# EAGLE design schemat (EAGLE 6.4)
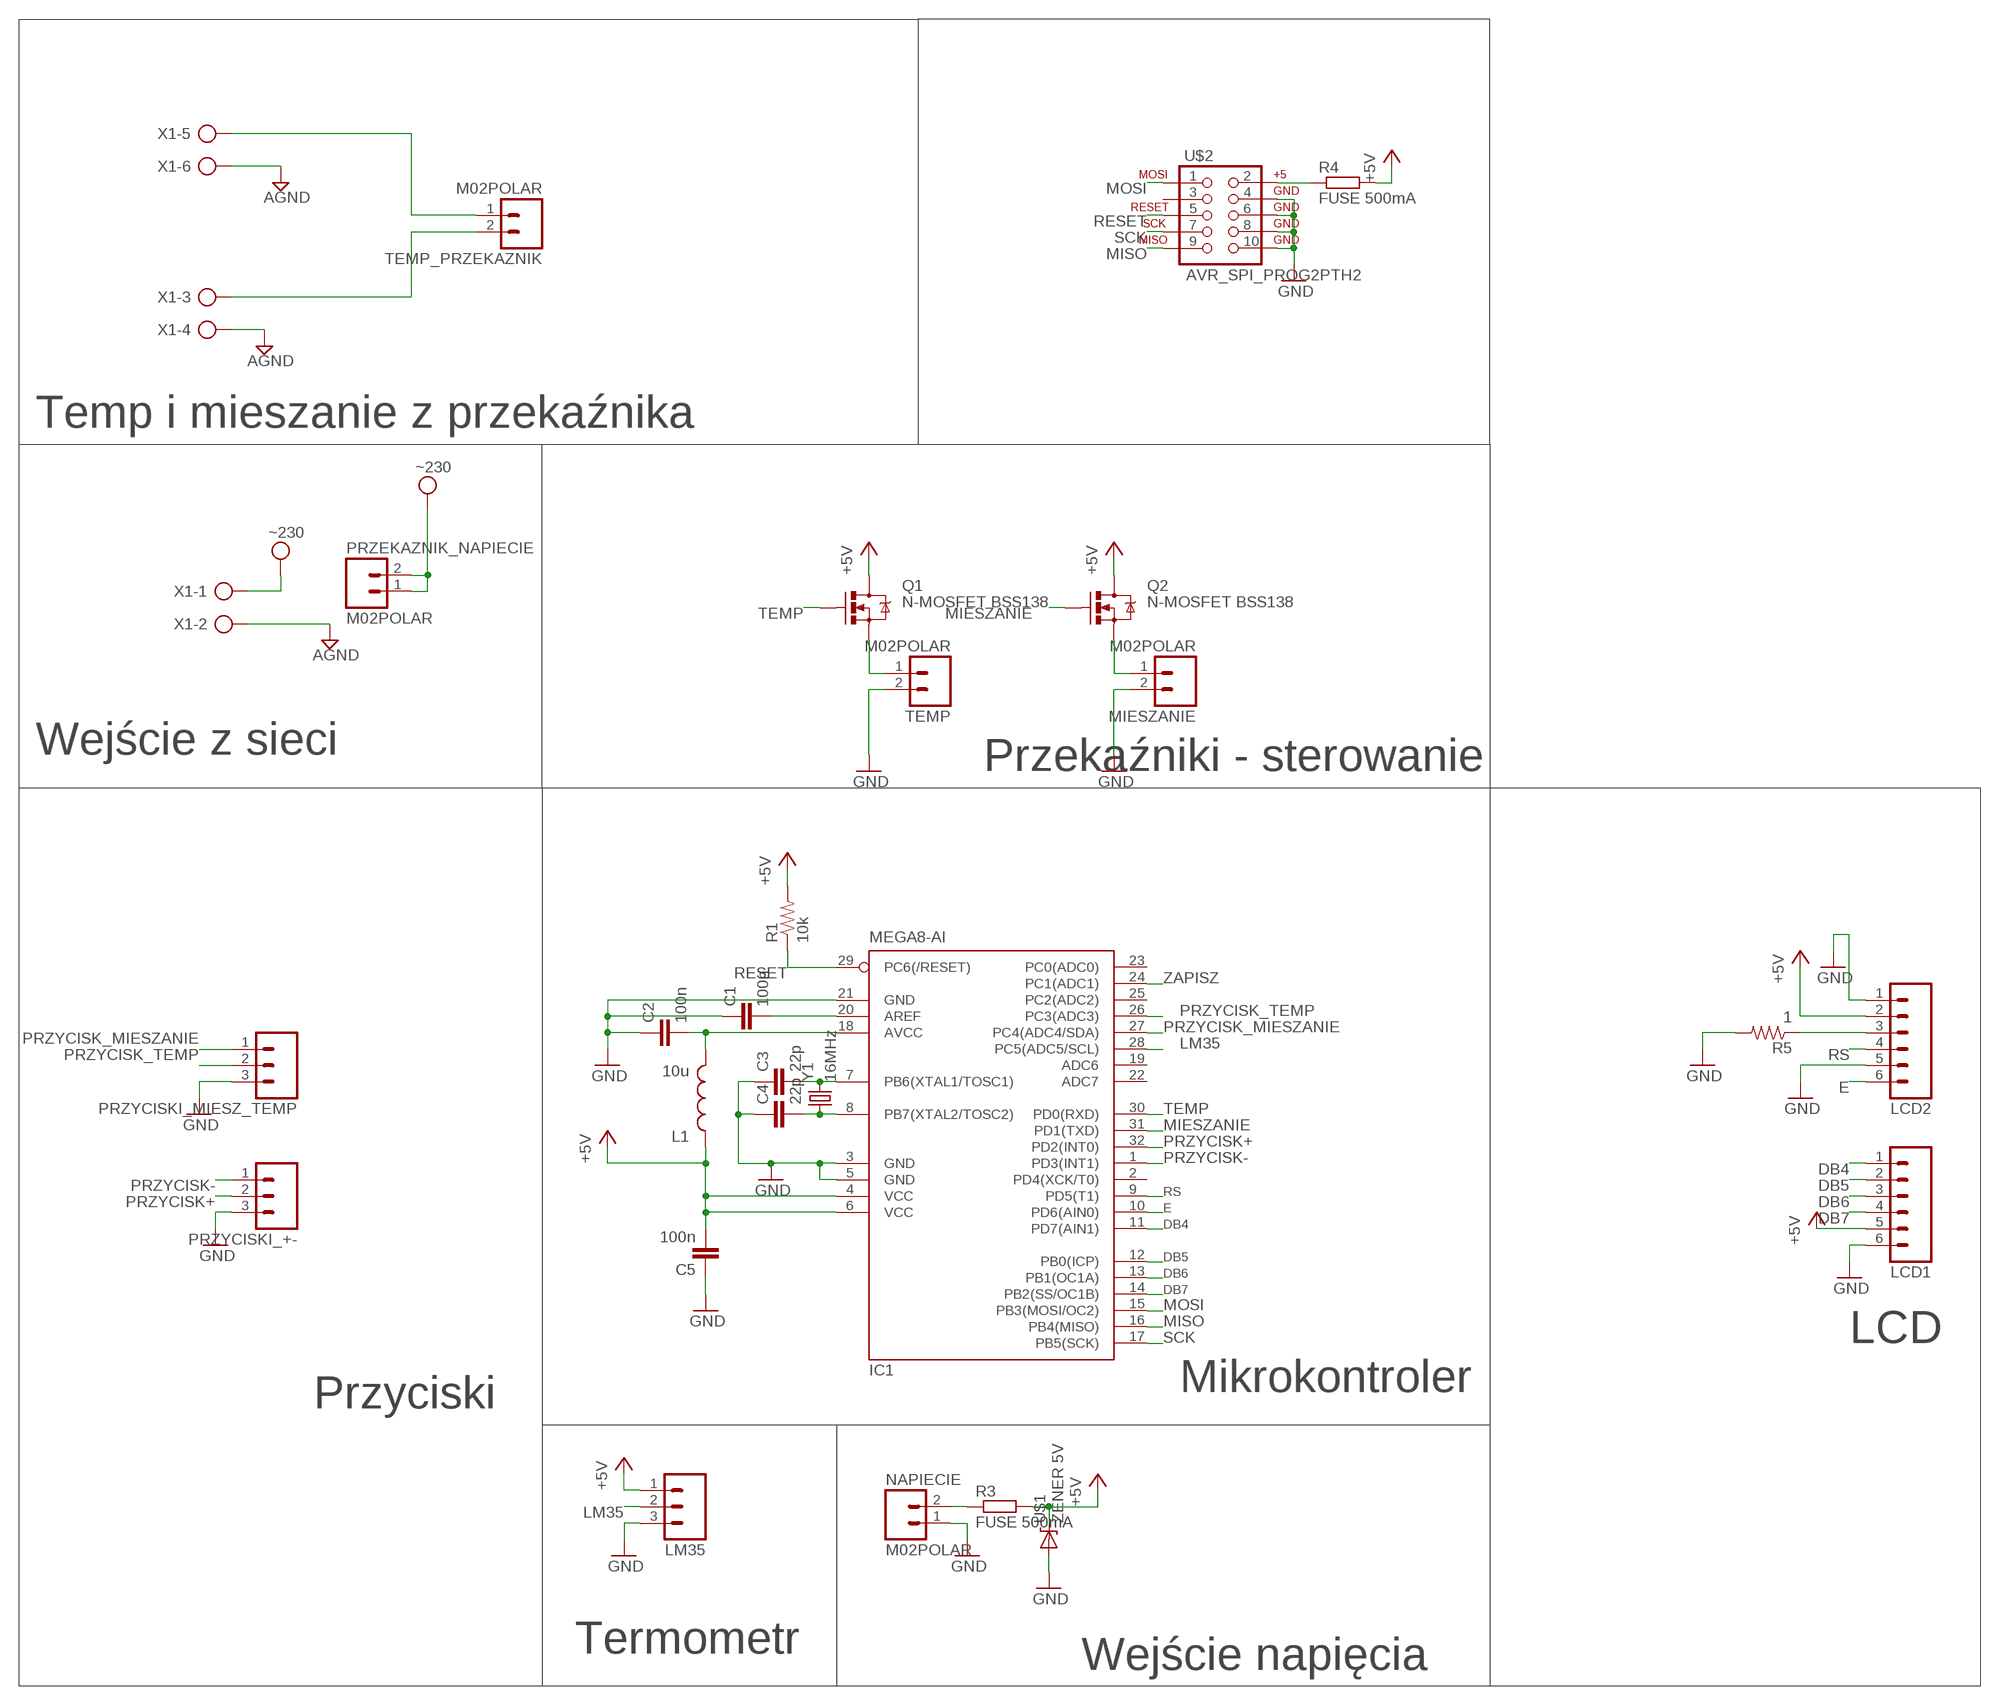
[diagram p0: schematic, sheet 1]

## Parts
C1  100n  CAP0805  [0805]
C2  100n  CAP0805  [0805]
C3  22p  CAP0805  [0805]
C4  22p  CAP0805  [0805]
C5  100n  CAP0805  [0805]
IC1  MEGA8-AI  [TQFP32-08]
L1  10u  INDUCTOR0805  [0805]
LCD1  M06POLAR  [MOLEX-1X6]
LCD2  M06POLAR  [MOLEX-1X6]
LM35  M03POLAR  [MOLEX-1X3]
MIESZANIE  M02POLAR  [MOLEX-1X2]
NAPIECIE  M02POLAR  [MOLEX-1X2]
PRZEKAZNIK_NAPIECIE  M02POLAR  [MOLEX-1X2]
PRZYCISKI_+-  M03POLAR  [MOLEX-1X3]
PRZYCISKI_MIESZ_TEMP  M03POLAR  [MOLEX-1X3]
Q1  N-MOSFET BSS138  MOSFET-NCHANNELBSS123LT1G  [SOT23]
Q2  N-MOSFET BSS138  MOSFET-NCHANNELBSS123LT1G  [SOT23]
R1  10k  RESISTOR0805-RES  [0805]
R3  FUSE 500mA  R-EU_M0805  [M0805]
R4  FUSE 500mA  R-EU_M0805  [M0805]
R5  1  RESISTOR0805-RES  [0805]
TEMP  M02POLAR  [MOLEX-1X2]
TEMP_PRZEKAZNIK  M02POLAR  [MOLEX-1X2]
U$1  ZENER 5V  DIODE-ZENERSMB  [SMB-DIODE]
U$2  AVR_SPI_PROG2PTH2  [2X5-SHROUDED]
X1  AK300/6  [AK300/6]
Y1  16MHz  CRYSTALHC49US  [HC49US]

## Nets
+5V: C5.2 IC1.4(VCC) IC1.6(VCC) L1.1 LCD1.5 LCD2.2 LM35.1 Q1.3(D) Q2.3(D) R1.2 R3.2 R4.2 U$1.C
AGND: X1.2 X1.4 X1.6
DB4: IC1.11(PD7(AIN1)) LCD1.1
DB5: IC1.12(PB0(ICP)) LCD1.2
DB6: IC1.13(PB1(OC1A)) LCD1.3
DB7: IC1.14(PB2(SS/OC1B)) LCD1.4
E: IC1.10(PD6(AIN0)) LCD2.6
GND: C1.1 C2.1 C3.1 C4.1 C5.1 IC1.3(GND) IC1.5(GND) IC1.21(GND) LCD1.6 LCD2.1 LCD2.5 LM35.3 MIESZANIE.2 NAPIECIE.1 PRZYCISKI_+-.3 PRZYCISKI_MIESZ_TEMP.3 R5.2 TEMP.2 U$1.A U$2.4 U$2.6 U$2.8 U$2.10
LM35: IC1.28(PC5(ADC5/SCL)) LM35.2
MIESZANIE: IC1.31(PD1(TXD)) Q2.1(G)
MISO: IC1.16(PB4(MISO)) U$2.9
MOSI: IC1.15(PB3(MOSI/OC2)) U$2.1
N$2: C2.2 IC1.18(AVCC) L1.2
N$3: C1.2 IC1.20(AREF)
N$4: Q1.2(S) TEMP.1
N$5: MIESZANIE.1 Q2.2(S)
N$6: C4.2 IC1.8(PB7(XTAL2/TOSC2)) Y1.1
N$7: C3.2 IC1.7(PB6(XTAL1/TOSC1)) Y1.2
N$8: NAPIECIE.2 R3.1
N$10: TEMP_PRZEKAZNIK.2 X1.3
N$11: R4.1 U$2.2
N$14: TEMP_PRZEKAZNIK.1 X1.5
N$16: LCD2.3 R5.1
PRZYCISK+: IC1.32(PD2(INT0)) PRZYCISKI_+-.2
PRZYCISK-: IC1.1(PD3(INT1)) PRZYCISKI_+-.1
PRZYCISK_MIESZANIE: IC1.27(PC4(ADC4/SDA)) PRZYCISKI_MIESZ_TEMP.1
PRZYCISK_TEMP: IC1.26(PC3(ADC3)) PRZYCISKI_MIESZ_TEMP.2
RESET: IC1.29(PC6(/RESET)) R1.1 U$2.5
RS: IC1.9(PD5(T1)) LCD2.4
SCK: IC1.17(PB5(SCK)) U$2.7
TEMP: IC1.30(PD0(RXD)) Q1.1(G)
VDD: PRZEKAZNIK_NAPIECIE.1 PRZEKAZNIK_NAPIECIE.2 X1.1 ; supply symbol labelled ~230
ZAPISZ: IC1.24(PC1(ADC1))
Unconnected: IC1.2(PD4(XCK/T0)) IC1.19(ADC6) IC1.22(ADC7) IC1.23(PC0(ADC0)) IC1.25(PC2(ADC2)) U$2.3

## Notes on the sheet
- Temp i mieszanie z przekaźnika
- Wejście z sieci
- Przekaźniki - sterowanie
- LCD
- Mikrokontroler
- Przyciski
- Termometr
- Wejście napięcia

## Library data of the parts
C1-C5 = SparkFun-Passives:CAP: Capacitor Standard 0603 ceramic capacitor, and 0.1" leaded capacitor.
IC1 = atmel:MEGA8: MICROCONTROLLER 8 Kbytes FLASH, 1 kbytes SRAM, 512 bytes EEPROM, USART, 6-channel 10 bit ADC, 2-channel 8 bit ADC Pin compatible with Atmega48, ATMega88, ATMega168 Source: avr.lbr; MPN: ATMEGA8-16AU; OC_FARNELL: 9171371; OC_NEWARK: 73M8863
L1 = SparkFun-Passives:INDUCTOR: Inductors Basic Inductor/Choke - 0603 and 1206. Footprints are not proven and vary greatly between part numbers. SRN6045- 33uH, 20% 1.4A SDR0403-560KL - 56uH, 10%, 500mA RMS/740mA peak
LCD1 LCD2 = SparkFun-Connectors:M06: Header 6 Standard 6-pin 0.1" header. Use with straight break away headers (SKU : PRT-00116), right angle break away headers (PRT-00553), swiss pins (PRT-00743), machine pins (PRT-00117), and female headers (PRT-00115). Molex polarized connector foot print use with SKU : PRT-08094 with associated crimp pins and housings. NOTES ON THE VARIANTS LOCK and LOCK_LONGPADS... This footprint was designed to help hold the alignment of a through-hole component (i.e. 6-pin header) while soldering it into place. You may notice that each hole has been shifted either up or down by 0.005 of an inch from it's more standard position (which is a perfectly straight line). This slight alteration caused the pins (the squares in the middle) to touch the edges of the holes. Because they are alternating, it causes a "brace" to hold the component in place. 0.005 has proven to be the perfect amount of "off-center" position when using our standard breakaway headers. Although looks a little odd when you look at the bare footprint, once you have a header in there, the alteration is very hard to notice. Also,if you push a header all the way into place, it is covered up entirely on the bottom side. This idea of altering the position of holes to aid alignment will be further integrated into the Sparkfun Library for other footprints. It can help hold any component with 3 or more connection pins.
LM35 PRZYCISKI_+- PRZYCISKI_MIESZ_TEMP = SparkFun-Connectors:M03: Header 3 Standard 3-pin 0.1" header. Use with straight break away headers (SKU : PRT-00116), right angle break away headers (PRT-00553), swiss pins (PRT-00743), machine pins (PRT-00117), and female headers (PRT-00115). Molex polarized connector foot print use with SKU : PRT-08232 with associated crimp pins and housings.
MIESZANIE NAPIECIE PRZEKAZNIK_NAPIECIE TEMP TEMP_PRZEKAZNIK = SparkFun-Connectors:M02: Standard 2-pin 0.1" header. Use with - straight break away headers ( PRT-00116) - right angle break away headers (PRT-00553) - swiss pins (PRT-00743) - machine pins (PRT-00117) - female headers (PRT-00115) Molex polarized connector foot print use with: PRT-08233 with associated crimp pins and housings. 2.54_SCREWTERM for use with PRT-10571. 3.5mm Screw Terminal footprints for PRT-08084 5mm Screw Terminal footprints for use with PRT-08433
Q1 Q2 = SparkFun-DiscreteSemi:MOSFET-NCHANNEL: Common NMOSFET Parts MFG P/N Store ID Prod ID FDD8780 TRANS-09984 SI7820DN TRANS-11055 FDS6630A IC-08089 2N7002PW TRANS-11151 FQP30N06L COM-10213 TRANS-10060 BSS123LT1G TRANS-08345 BSS138 TRANS-00830 BS170 2N7000; PROD_ID: TRANS-08345
R1 R5 = SparkFun-Passives:RESISTOR: Resistor Basic schematic elements and footprints for 0603, 1206, and PTH resistors.
R3 R4 = resistor:R-EU_: RESISTOR, European symbol
U$1 = SparkFun-DiscreteSemi:DIODE-ZENER: Zener Diode Production Part - 8199 3.4V Zener Voltage
U$2 = SparkFun-Connectors:AVR_SPI_PROG2: AVR 10-pin ICSP Header This is the standard AVR In Circuit Serial Programming header. Minimal, but includes pin one indicator. Works with standard Olimex programmers. Also look for the 6-pin reduced version. Spark Fun Electronics SKU: PRT-00778
X1 = con-ptr500:AK300/6: CONNECTOR; OC_FARNELL: unknown; OC_NEWARK: unknown
Y1 = SparkFun-FreqCtrl:CRYSTAL: Various standard crystals. Proven footprints. Spark Fun Electronics SKU : COM-00534

## Board
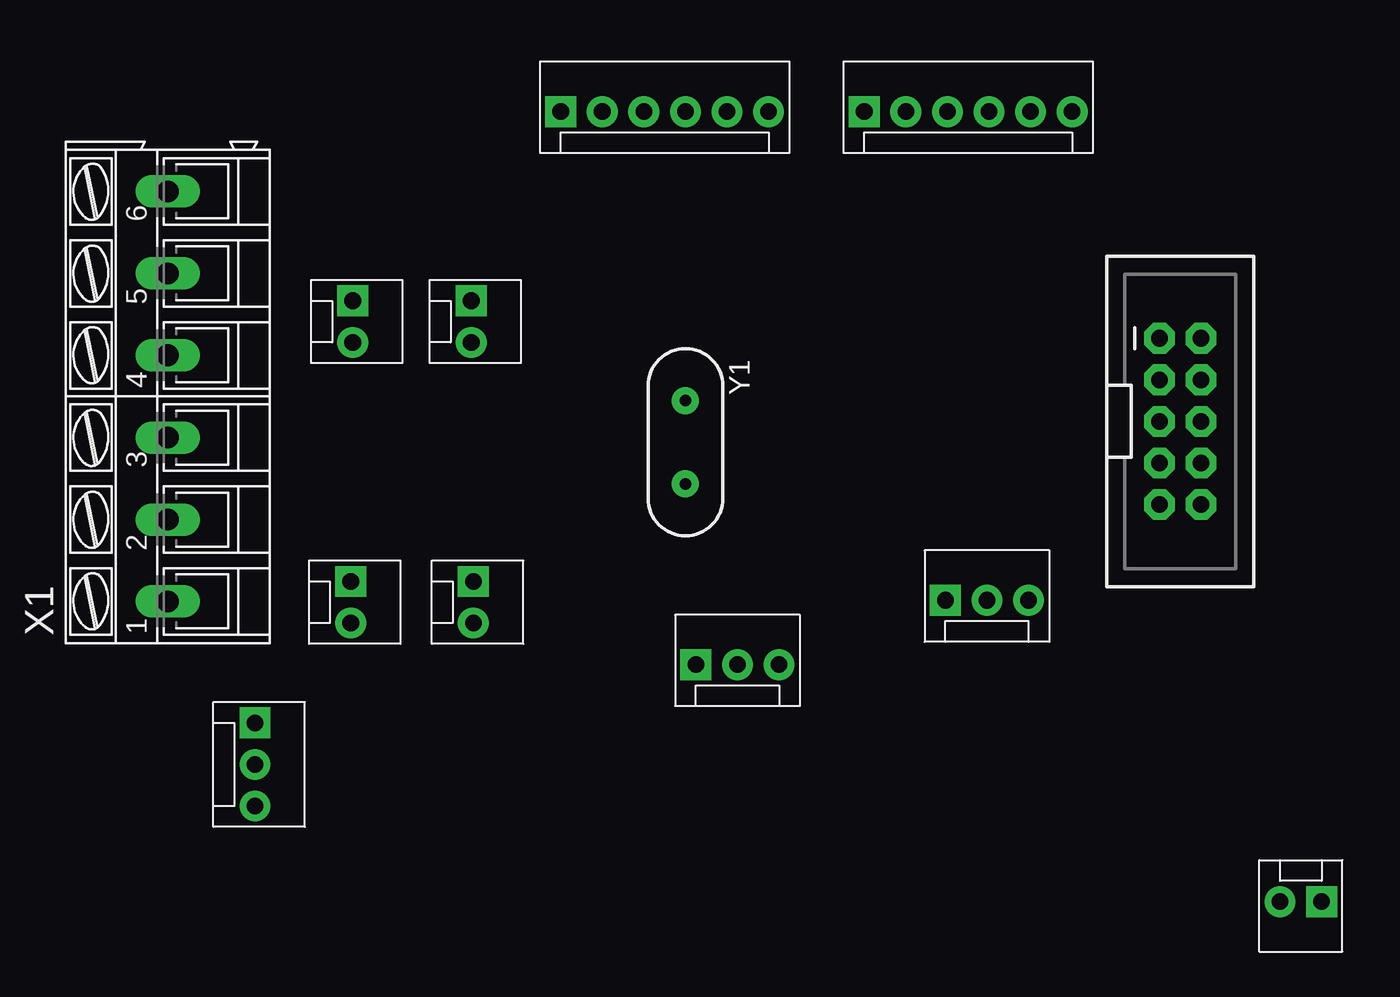
[diagram p1: board, top side]
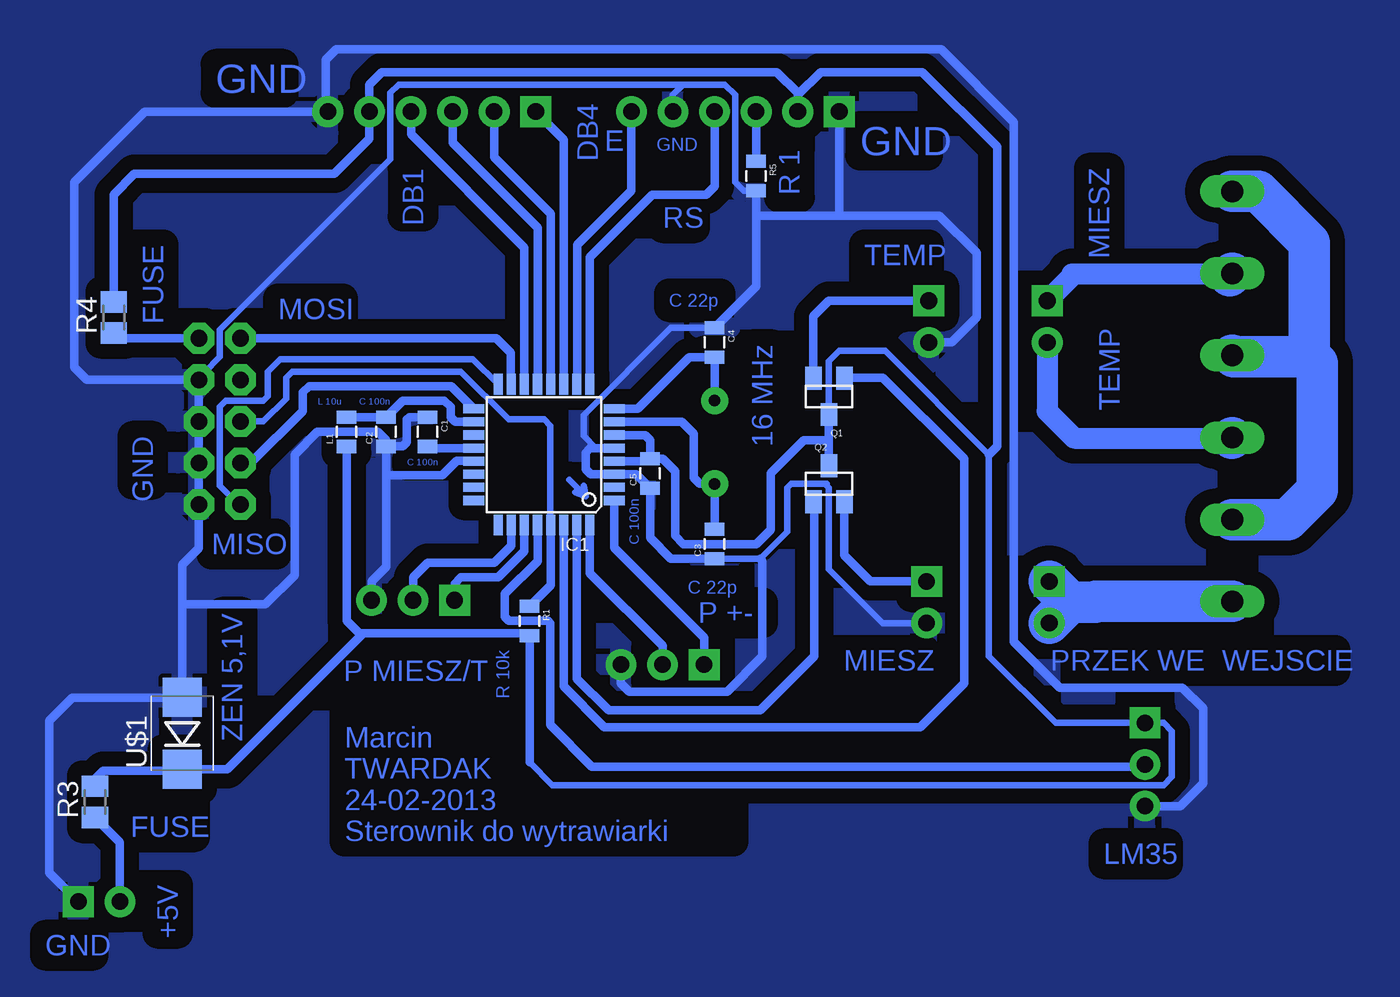
[diagram p2: board, bottom side, seen from below]

No outline drawn. Coordinates in mm, seen from the top.
Copper layers (1*16): Top 0.035mm / dielectric 1.5mm / Bottom 0.035mm
Design rules "default": minimum track width 10mil, minimum drill 24mil, track to track 8mil, track to pad 8mil, pad to pad 8mil, via to via 8mil, smd to smd 8mil, copper to edge 40mil, drill to drill 8mil, minimum pad ring 10mil, minimum via ring 8mil, stop-mask expansion 4mil, vias tented up to drill 0mil, thermal gap 10mil

### Footprints (pad centres in the part's own frame; a part is rotated, then mirrored left to right if it is on the bottom)
0805 = smd 0.8 x 1.2: 1 -0.9,0; 2 0.9,0
TQFP32-08 = smd 1.27 x 0.559: 1 -4.293,2.8; 2 -4.293,2; 3 -4.293,1.2; 4 -4.293,0.4; 5 -4.293,-0.4; 6 -4.293,-1.2; 7 -4.293,-2; 8 -4.293,-2.8; 17 4.293,-2.8; 18 4.293,-2; 19 4.293,-1.2; 20 4.293,-0.4; 21 4.293,0.4; 22 4.293,1.2; 23 4.293,2; 24 4.293,2.8 | smd 0.559 x 1.27: 9 -2.8,-4.293; 10 -2,-4.293; 11 -1.2,-4.293; 12 -0.4,-4.293; 13 0.4,-4.293; 14 1.2,-4.293; 15 2,-4.293; 16 2.8,-4.293; 25 2.8,4.293; 26 2,4.293; 27 1.2,4.293; 28 0.4,4.293; 29 -0.4,4.293; 30 -1.2,4.293; 31 -2,4.293; 32 -2.8,4.293
MOLEX-1X6 = drill 1.016 pad 1.88 square: 1 0,0 | drill 1.016 pad 1.88: 2 2.54,0; 3 5.08,0; 4 7.62,0; 5 10.16,0; 6 12.7,0
MOLEX-1X3 = drill 1.016 pad 1.88 square: 1 0,0 | drill 1.016 pad 1.88: 2 2.54,0; 3 5.08,0
MOLEX-1X2 = drill 1.016 pad 1.88 square: 1 0,0 | drill 1.016 pad 1.88: 2 2.54,0
SOT23 = smd 1 x 1.4: 1 -0.95,-1.1; 2 0.95,-1.1; 3 0,1.1
M0805 = smd 1.3 x 1.6: 1 -0.95,0; 2 0.95,0
SMB-DIODE = smd 2.4 x 2.4: A 2.2,0; C -2.2,0
2X5-SHROUDED = drill 1.016 pad 1.88 octagon: 1 -1.27,5.08; 2 1.27,5.08; 3 -1.27,2.54; 4 1.27,2.54; 5 -1.27,0; 6 1.27,0; 7 -1.27,-2.54; 8 1.27,-2.54; 9 -1.27,-5.08; 10 1.27,-5.08
AK300/6 = drill 1.321 long: 1 -12.522,0; 2 -7.518,0; 3 -2.515,0; 4 2.515,0; 5 7.518,0; 6 12.522,0
HC49US = drill 0.7 pad 1.651: 1 -2.54,0; 2 2.54,0

### Placement (x,y rotation side)
C1  51.69,100.46 270 bottom
C2  54.23,100.46 90 bottom
C3  34.16,93.6 90 bottom
C4  34.16,105.92 270 bottom
C5  38.1,97.92 90 bottom
IC1  44.58,99.06 180 bottom
L1  56.64,100.46 90 bottom
LCD1  45.09,120.02 0 top
LCD2  26.54,120.02 0 top
LM35  7.87,82.68 270 top
MIESZANIE  21.21,91.31 270 top
NAPIECIE  73.03,71.75 180 top
PRZEKAZNIK_NAPIECIE  13.72,91.31 270 top
PRZYCISKI_+-  34.8,86.23 0 top
PRZYCISKI_MIESZ_TEMP  50.04,90.17 0 top
Q1  27.18,102.62 180 bottom
Q2  27.18,97.28 0 bottom
R1  45.47,88.9 270 bottom
R3  72.01,77.85 90 bottom
R4  70.87,107.44 90 bottom
R5  31.62,116.08 270 bottom
TEMP  21.08,108.46 270 top
TEMP_PRZEKAZNIK  13.84,108.46 270 top
U$1  66.67,82.04 90 bottom
U$2  64.39,101.09 0 top
X1  2.54,102.62 90 top
Y1  34.16,99.82 270 top

### Tracks (layer width: path | path; a pad name or v marks a point on that pad's centre or on a via)
+5V
  Bottom 0.406: Q1.3 27.18,104.78 26.54,105.41 23.75,105.41 17.4,99.06 17.4,86.74 13.34,82.68 LM35.1 6.73,82.68 6.22,82.17 6.22,79.38 6.73,78.87 44.07,78.87 45.47,80.26
  Bottom 0.508: R4.2 70.87,114.94 69.6,116.2 57.4,116.2 55.24,118.36 LCD1.5 55.24,121.67 54.48,122.43 30.35,122.43 29.08,121.16 LCD2.2 29.08,121.03 27.69,122.43 21.46,122.43 16.89,117.86 16.89,99.57 17.4,99.06 | R3.2 72.01,79.25 71.5,79.76 66.76,79.76 U$1.C 63.92,79.84 55.63,88.14 | L1.1 56.64,88.9 55.88,88.14 55.63,88.14 | IC1.4 38.26,98.66 C5.2 | 27.18,99.95 Q1.3 | Q2.3 27.18,99.95 | 27.18,99.95 28.7,99.95 30.73,97.92 30.73,94.49 31.62,93.6 36.07,93.6 36.58,94.11 36.58,98.04 37.34,98.81 38.09,98.81 C5.2 | IC1.6 38.41,100.26 38.1,99.95 C5.2 | 45.47,80.26 R1.2 45.6,88.14 55.63,88.14
AGND
  Bottom 2.54: X1.2 -0.86,95.1 -2.67,96.9 -2.67,104.52 | -2.67,104.52 -2.67,104.65 -2.29,105.03 2.44,105.03 X1.4 | X1.6 0.96,115.14 -2.16,112.01 -2.16,105.03 -2.67,104.52
DB4
  Bottom 0.508: IC1.11 43.38,118.31 LCD1.1
DB5
  Bottom 0.508: IC1.12 44.18,113.77 47.62,117.22 LCD1.2
DB6
  Bottom 0.508: IC1.13 44.98,112.92 50.16,118.11 LCD1.3
DB7
  Bottom 0.508: IC1.14 45.78,111.69 52.7,118.62 LCD1.4
E
  Bottom 0.508: IC1.10 42.55,103.35 42.55,111.89 39.24,115.19 LCD2.6
GND
  Bottom 0.406: LCD2.5 36.7,121.03 36.07,121.67 | 36.07,121.67 33.53,121.67 32.89,121.03 32.89,115.7 32.38,115.19 31.63,115.19 R5.2 | MIESZANIE.2 23.88,88.77 27.18,92.08 27.18,97.03 27.43,97.28 | 27.3,97.28 27.43,97.28 | 27.43,97.28 29.46,97.28 29.72,97.03 29.72,94.36 31.37,92.71 C3.1 | IC1.5 41.42,99.46 42.16,100.2 42.16,101.47 36.83,106.81 34.17,106.81 C4.1 | U$2.4 65.66,103.76 65.34,104.08 64.39,105.03 64.39,106.68 53.98,117.09 53.98,121.16 53.47,121.67 36.07,121.67
  Bottom 0.508: U$2.4 U$2.6 U$2.8 U$2.10 65.66,93.34 66.67,92.33 66.67,89.79 | C1.1 52.82,101.36 52.96,101.22 52.96,99.82 53.21,99.57 54.22,99.57 C2.1 | IC1.21 48.89,98.68 49.91,98.68 50.8,97.79 54.23,97.79 | C2.1 54.23,97.79 | 54.23,97.79 54.23,92.2 55.12,91.31 PRZYCISKI_MIESZ_TEMP.3 | C2.1 54.23,99.95 54.74,100.46 58.42,100.46 59.82,99.06 59.82,91.69 61.59,89.92 66.55,89.92 66.67,89.79 | 66.67,89.79 U$1.A 66.72,84.2 73.41,84.2 74.8,82.8 74.8,73.53 NAPIECIE.1 | IC1.5 40.3,99.44 41.78,99.44 42.04,99.19 42.04,98.17 41.73,97.86 IC1.3 38.94,97.86 C5.1 38.1,93.98 36.83,92.71 34.17,92.71 C3.1 | R5.2 31.62,113.54 | 31.62,113.54 31.62,109.36 C4.1 | TEMP.2 19.68,105.92 18.16,107.44 18.16,111.38 20.45,113.67 26.42,113.67 | 26.42,113.67 31.5,113.67 31.62,113.54 | LCD2.1 26.54,113.79 26.42,113.67 | PRZYCISKI_+-.3 39.88,85.09 39.37,84.58 33.4,84.58 31.24,86.74 31.24,92.58 31.37,92.71 | 65.34,104.08 65.79,103.63 72.52,103.63 73.28,104.39 73.28,115.7 68.96,120.02 LCD1.6 57.91,120.14 57.91,123.19 57.28,123.83 20.32,123.83 15.88,119.38 15.88,87.63 13.08,84.84 5.59,84.84 4.32,83.57 4.32,78.99 5.71,77.6 LM35.3
  pour Bottom (isolate 0.914): -11.43,128.78 85.22,128.78 85.22,63.88 -11.43,63.88
LM35
  Bottom 0.508: IC1.28 44.98,92.56 46.99,90.55 46.99,89.15 46.74,88.9 44.32,88.9 44.2,88.77 44.2,82.55 41.66,80.01 8,80.01 LM35.2
MIESZANIE
  Bottom 0.508: IC1.31 42.58,85.38 40.64,83.44 31.37,83.44 28.07,86.74 28.07,96.12 Q2.1
MISO
  Bottom 0.406: U$2.9 63.25,96.01 64.39,97.16 64.39,101.98 64.01,102.36 61.72,102.36 61.47,102.62 61.47,104.14 60.71,104.9 48.93,104.9 IC1.16
MOSI
  Bottom 0.508: U$2.1 47.5,106.17 46.61,105.28 46.61,103.39 IC1.15
N$1
  Bottom 0.406: 43.05,97.54 42.04,96.52 | 42.04,96.52 42.16,97.16 | 42.04,96.52 42.67,96.77
N$2
  Bottom 0.508: IC1.18 50.01,101.06 50.29,101.35 50.29,101.98 50.67,102.36 53.22,102.36 C2.2 L1.2
N$3
  Bottom 0.508: IC1.20 51.59,99.46 C1.2
N$4
  Bottom 0.508: Q1.2 28.13,107.51 27.18,108.46 TEMP.1
N$5
  Bottom 0.508: Q2.2 26.23,92.9 24.64,91.31 MIESZANIE.1
N$6
  Bottom 0.508: Y1.1 C4.2 35.7,105.02 38.86,101.85 IC1.8
N$7
  Bottom 0.508: C3.2 Y1.2 35.05,97.28 35.43,97.66 35.43,100.33 36.16,101.06 IC1.7
N$8
  Bottom 0.508: NAPIECIE.2 70.48,75.38 R3.1
N$10
  Bottom 1.27: TEMP_PRZEKAZNIK.2 13.84,101.73 12.19,100.08 2.56,100.08
  Bottom 2.54: 2.56,100.08 X1.3
N$11
  Bottom 0.508: U$2.2 70.55,106.17 R4.1
N$14
  Bottom 1.27: X1.5 2.56,110.11 12.32,110.11 12.32,109.98 TEMP_PRZEKAZNIK.1
  Bottom 2.54: 2.69,109.98 X1.5
N$16
  Bottom 0.508: LCD2.3 R5.1
PRZYCISK+
  Bottom 0.508: PRZYCISKI_+-.2 37.34,87.38 41.78,91.82 IC1.32
PRZYCISK-
  Bottom 0.508: IC1.1 40.28,93.37 34.8,87.88 PRZYCISKI_+-.1
PRZYCISK_MIESZANIE
  Bottom 0.508: IC1.27 45.78,93.16 47.37,91.57 49.66,91.57 50.04,91.19 PRZYCISKI_MIESZ_TEMP.1
PRZYCISK_TEMP
  Bottom 0.508: IC1.26 46.58,93.5 47.62,92.46 51.69,92.46 52.58,91.57 PRZYCISKI_MIESZ_TEMP.2
RESET
  Bottom 0.406: IC1.29 44.2,94.79 44.2,100.84 44.58,101.22 46.74,101.22 49.66,104.14 59.94,104.14 60.33,103.76 60.33,102.49 61.72,101.09 U$2.5
  Bottom 0.508: IC1.29 44.18,91.09 R1.1
RS
  Bottom 0.508: IC1.9 41.78,111.13 37.97,114.94 34.67,114.94 34.16,115.44 LCD2.4
SCK
  Bottom 0.406: IC1.17
  Bottom 0.508: U$2.7 62.48,98.55 59.31,101.73 59.31,102.87 58.93,103.25 50.26,103.25 IC1.17
TEMP
  Bottom 0.508: IC1.30 43.38,84.91 40.89,82.42 21.59,82.42 18.92,85.09 18.92,98.81 23.88,103.76 26.18,103.76 Q1.1
VDD
  Bottom 2.54: X1.1 10.87,90.09 10.92,90.04 12.45,90.04 | 12.45,90.04 PRZEKAZNIK_NAPIECIE.2 | PRZEKAZNIK_NAPIECIE.1 12.45,90.04

### Text on the board
Bottom: DB4 | GND | R 1 | GND | E | MIESZ | GND | DB1 | RS | FUSE | TEMP | C 22p | TEMP | MOSI | 16 MHz | C 100n | L 10u | GND | C 100n | C 100n | MISO | C 22p | P +- | PRZEK WE | R 10k | WEJSCIE | MIESZ | P MIESZ/T | ZEN 5,1V | FUSE | Marcin / TWARDAK / 24-02-2013 / Sterownik do wytrawiarki | LM35 | +5V | GND